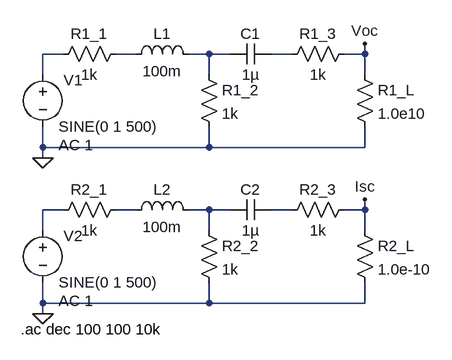
[diagram p0: schematic lab9.asc]
lab9.asc, the LTspice schematic file:
Version 4
SHEET 1 880 680
WIRE -80 32 -112 32
WIRE 32 32 0 32
WIRE 144 32 112 32
WIRE 176 32 144 32
WIRE 272 32 240 32
WIRE 384 32 384 16
WIRE 384 32 352 32
WIRE -112 64 -112 32
WIRE 144 64 144 32
WIRE 384 64 384 32
WIRE -112 176 -112 144
WIRE 144 176 144 144
WIRE 144 176 -112 176
WIRE 384 176 384 144
WIRE 384 176 144 176
WIRE -112 192 -112 176
WIRE -80 272 -112 272
WIRE 32 272 0 272
WIRE 144 272 112 272
WIRE 176 272 144 272
WIRE 272 272 240 272
WIRE 384 272 384 256
WIRE 384 272 352 272
WIRE -112 304 -112 272
WIRE 144 304 144 272
WIRE 384 304 384 272
WIRE -112 416 -112 384
WIRE 144 416 144 384
WIRE 144 416 -112 416
WIRE 384 416 384 384
WIRE 384 416 144 416
WIRE -112 432 -112 416
FLAG 384 16 Voc
FLAG -112 192 0
FLAG 384 256 Isc
FLAG -112 432 0
SYMBOL voltage -112 48 R0
WINDOW 0 32 24 Left 2
WINDOW 123 24 124 Left 2
WINDOW 39 0 0 Left 2
SYMATTR InstName V1
SYMATTR Value SINE(0 1 500)
SYMATTR Value2 AC 1
SYMBOL res -96 48 R270
WINDOW 0 32 56 VTop 2
WINDOW 3 0 56 VBottom 2
SYMATTR InstName R1_1
SYMATTR Value 1k
SYMBOL ind 16 48 R270
WINDOW 0 32 56 VTop 2
WINDOW 3 5 56 VBottom 2
SYMATTR InstName L1
SYMATTR Value 100m
SYMBOL res 128 48 R0
SYMATTR InstName R1_2
SYMATTR Value 1k
SYMBOL cap 176 48 R270
WINDOW 0 32 32 VTop 2
WINDOW 3 0 32 VBottom 2
SYMATTR InstName C1
SYMATTR Value 1µ
SYMBOL res 256 48 R270
WINDOW 0 32 56 VTop 2
WINDOW 3 0 56 VBottom 2
SYMATTR InstName R1_3
SYMATTR Value 1k
SYMBOL res 368 48 R0
SYMATTR InstName R1_L
SYMATTR Value 1.0e10
SYMBOL voltage -112 288 R0
WINDOW 0 32 24 Left 2
WINDOW 123 24 124 Left 2
WINDOW 39 0 0 Left 2
SYMATTR InstName V2
SYMATTR Value SINE(0 1 500)
SYMATTR Value2 AC 1
SYMBOL res -96 288 R270
WINDOW 0 32 56 VTop 2
WINDOW 3 0 56 VBottom 2
SYMATTR InstName R2_1
SYMATTR Value 1k
SYMBOL ind 16 288 R270
WINDOW 0 32 56 VTop 2
WINDOW 3 5 56 VBottom 2
SYMATTR InstName L2
SYMATTR Value 100m
SYMBOL res 128 288 R0
SYMATTR InstName R2_2
SYMATTR Value 1k
SYMBOL cap 176 288 R270
WINDOW 0 32 32 VTop 2
WINDOW 3 0 32 VBottom 2
SYMATTR InstName C2
SYMATTR Value 1µ
SYMBOL res 256 288 R270
WINDOW 0 32 56 VTop 2
WINDOW 3 0 56 VBottom 2
SYMATTR InstName R2_3
SYMATTR Value 1k
SYMBOL res 368 288 R0
SYMATTR InstName R2_L
SYMATTR Value 1.0e-10
TEXT -146 456 Left 2 !.ac dec 100 100 10k

The netlist it stands for:
* lab9.asc
V1 N001 0 SINE(0 1 500) AC 1
R1_1 N001 N002 1k
L1 N002 N003 100m
R1_2 N003 0 1k
C1 N003 N004 1µ
R1_3 N004 Voc 1k
R1_L Voc 0 1.0e10
V2 N005 0 SINE(0 1 500) AC 1
R2_1 N005 N006 1k
L2 N006 N007 100m
R2_2 N007 0 1k
C2 N007 N008 1µ
R2_3 N008 Isc 1k
R2_L Isc 0 1.0e-10
.ac dec 100 100 10k
.backanno
.end

* Results of the author's LTspice run, read from the files saved beside the schematic
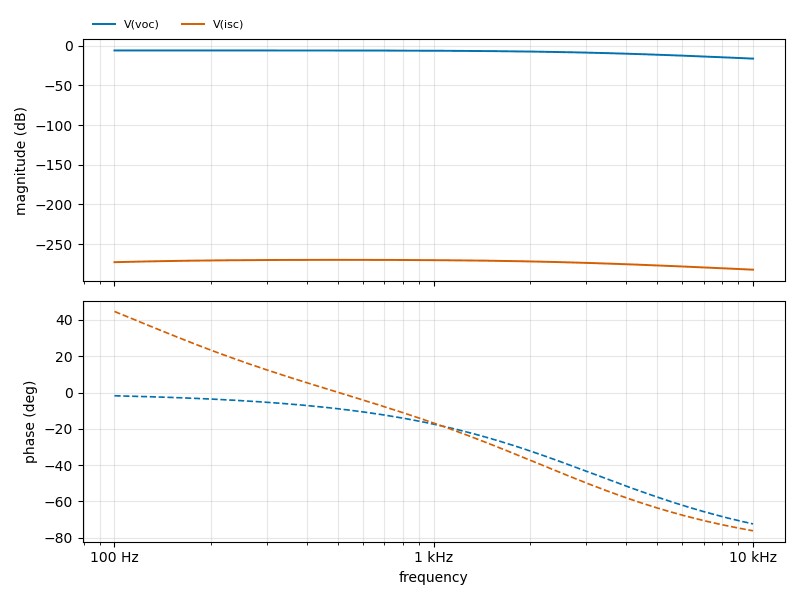
[diagram p1: AC Analysis of lab9.asc, plotted from the saved traces]
* AC Analysis, 1 run:
*   V(voc): -6.02 dB at 100 Hz, -16.38 dB at 10 kHz, peak -6.02 dB at 100 Hz, 3 dB below the peak at 3.186 kHz
*   V(isc): -272.78 dB at 100 Hz, -282.22 dB at 10 kHz, peak -269.83 dB at 501.2 Hz, 3 dB below the peak at 2.566 kHz